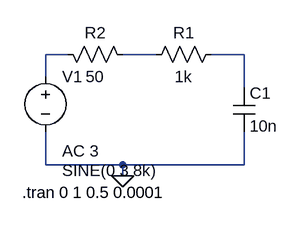
[diagram p0: schematic Draft4.asc]
Draft4.asc, the LTspice schematic file:
Version 4
SHEET 1 880 680
WIRE -16 96 -48 96
WIRE 112 96 64 96
WIRE 240 96 192 96
WIRE -48 128 -48 96
WIRE 240 144 240 96
WIRE -48 256 -48 208
WIRE 64 256 -48 256
WIRE 240 256 240 208
WIRE 240 256 64 256
WIRE 64 272 64 256
FLAG 64 272 0
SYMBOL res 208 80 R90
WINDOW 0 0 56 VBottom 2
WINDOW 3 32 56 VTop 2
SYMATTR InstName R1
SYMATTR Value 1k
SYMBOL cap 224 144 R0
SYMATTR InstName C1
SYMATTR Value 10n
SYMBOL voltage -48 112 R0
WINDOW 3 24 152 Left 2
WINDOW 123 24 124 Left 2
WINDOW 39 0 0 Left 0
SYMATTR InstName V1
SYMATTR Value SINE(0 3 8k)
SYMATTR Value2 AC 3
SYMBOL res -32 80 M90
WINDOW 0 0 56 VBottom 2
WINDOW 3 32 56 VTop 2
SYMATTR InstName R2
SYMATTR Value 50
TEXT -82 296 Left 2 !.tran 0 1 0.5 0.0001

The netlist it stands for:
* Draft4.asc
R1 N003 N002 1k
C1 N003 0 10n
V1 N001 0 SINE(0 3 8k) AC 3
R2 N001 N002 50
.tran 0 1 0.5 0.0001
.backanno
.end